# EAGLE design invamp (EAGLE 7.6.0)
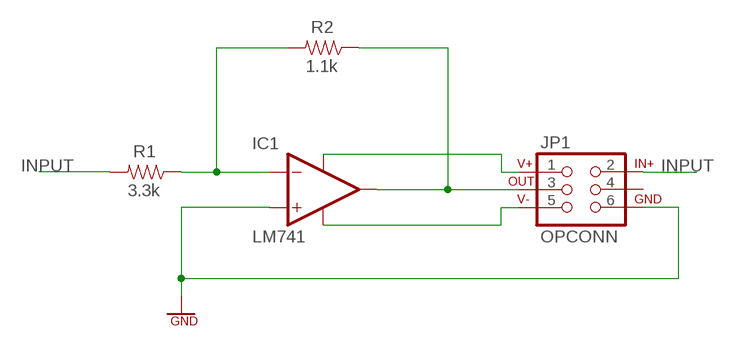
[diagram p0: schematic, sheet 1]

## Parts
IC1  LM741  [SO08]
JP1  OPCONN  [2X3]
R1  3.3k  RES_0603  [SMD0603]
R2  1.1k  RES_0603  [SMD0603]

## Nets
GND: IC1.3(IN+) JP1.6
INPUT: JP1.2 R1.2
N$1: IC1.2(IN-) R1.1 R2.2
N$2: IC1.6(OUT) JP1.3 R2.1
N$3: IC1.7(V+) JP1.1
N$4: IC1.4(V-) JP1.5
Unconnected: JP1.4

## Library data of the parts
IC1 = eagle-book:LM741: LM741 Operational Amplifier
JP1 = eagle-book:OPCONN: 6-pin connector for the op-amp circuit
R1 R2 = eagle-book:RES: Resistor

## Board
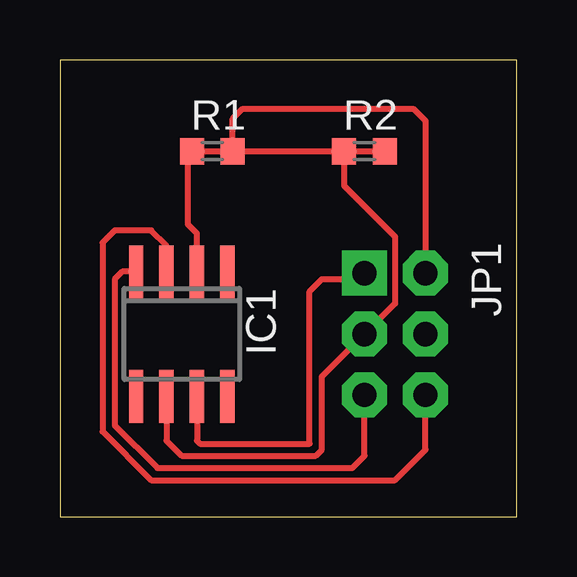
[diagram p1: board, top side]

Size 19.05 x 19.05 mm. Coordinates in mm from the lower left corner, seen from the top.
Outline: 0,0 19.05,0 19.05,19.05 0,19.05 0,0
Copper layers (1*16): Top 0.035mm / dielectric 1.5mm / Bottom 0.035mm
Design rules "default": minimum track width 10mil, minimum drill 24mil, track to track 8mil, track to pad 8mil, pad to pad 8mil, via to via 8mil, smd to smd 8mil, copper to edge 40mil, drill to drill 8mil, minimum pad ring 10mil, minimum via ring 8mil, stop-mask expansion 4mil, vias tented up to drill 0mil, thermal gap 10mil

### Footprints (pad centres in the part's own frame; a part is rotated, then mirrored left to right if it is on the bottom)
SO08 = smd 0.6 x 2.2: 1 -1.905,-2.6; 2 -0.635,-2.6; 3 0.635,-2.6; 4 1.905,-2.6; 5 1.905,2.6; 6 0.635,2.6; 7 -0.635,2.6; 8 -1.905,2.6
2X3 = drill 1.016 pad 1.88 square: 1 -2.54,-1.27 | drill 1.016 pad 1.88 octagon: 2 -2.54,1.27; 3 0,-1.27; 4 0,1.27; 5 2.54,-1.27; 6 2.54,1.27
SMD0603 = smd 1 x 1.1: 1 -0.85,0; 2 0.85,0

### Placement (x,y rotation side)
IC1  5.08,7.62 180 top
JP1  13.97,7.62 270 top
R1  6.35,15.24 0 top
R2  12.7,15.24 0 top

### Tracks (layer width: path | path; a pad name or v marks a point on that pad's centre or on a via)
GND
  Top 0.254: 4.34,10.06 IC1.3 4.45,11.3 3.81,11.94 2.29,11.94 1.78,11.43 1.78,3.56 3.81,1.52 13.97,1.52 15.24,2.79 JP1.6
INPUT
  Top 0.254: R1.2 7.2,16.6 7.62,17.02 14.73,17.02 15.24,16.51 JP1.2
N$1
  Top 0.254: IC1.2 5.71,11.81 5.33,12.19 5.33,15.07 R1.1 R2.2
N$2
  Top 0.254: R2.1 11.85,13.8 13.97,11.68 13.97,8.89 JP1.3 10.92,5.84 10.92,2.79 10.67,2.54 5.08,2.54 4.45,3.17 IC1.6
N$3
  Top 0.254: IC1.7 5.71,3.17 5.84,3.05 10.41,3.05 10.41,9.4 10.92,9.91 12.45,9.91 JP1.1
N$4
  Top 0.254: IC1.4 2.6,10.22 2.29,9.91 2.29,3.81 4.06,2.03 12.19,2.03 12.7,2.54 JP1.5